# EAGLE schematic shared_pcb (EAGLE 7.5.0)
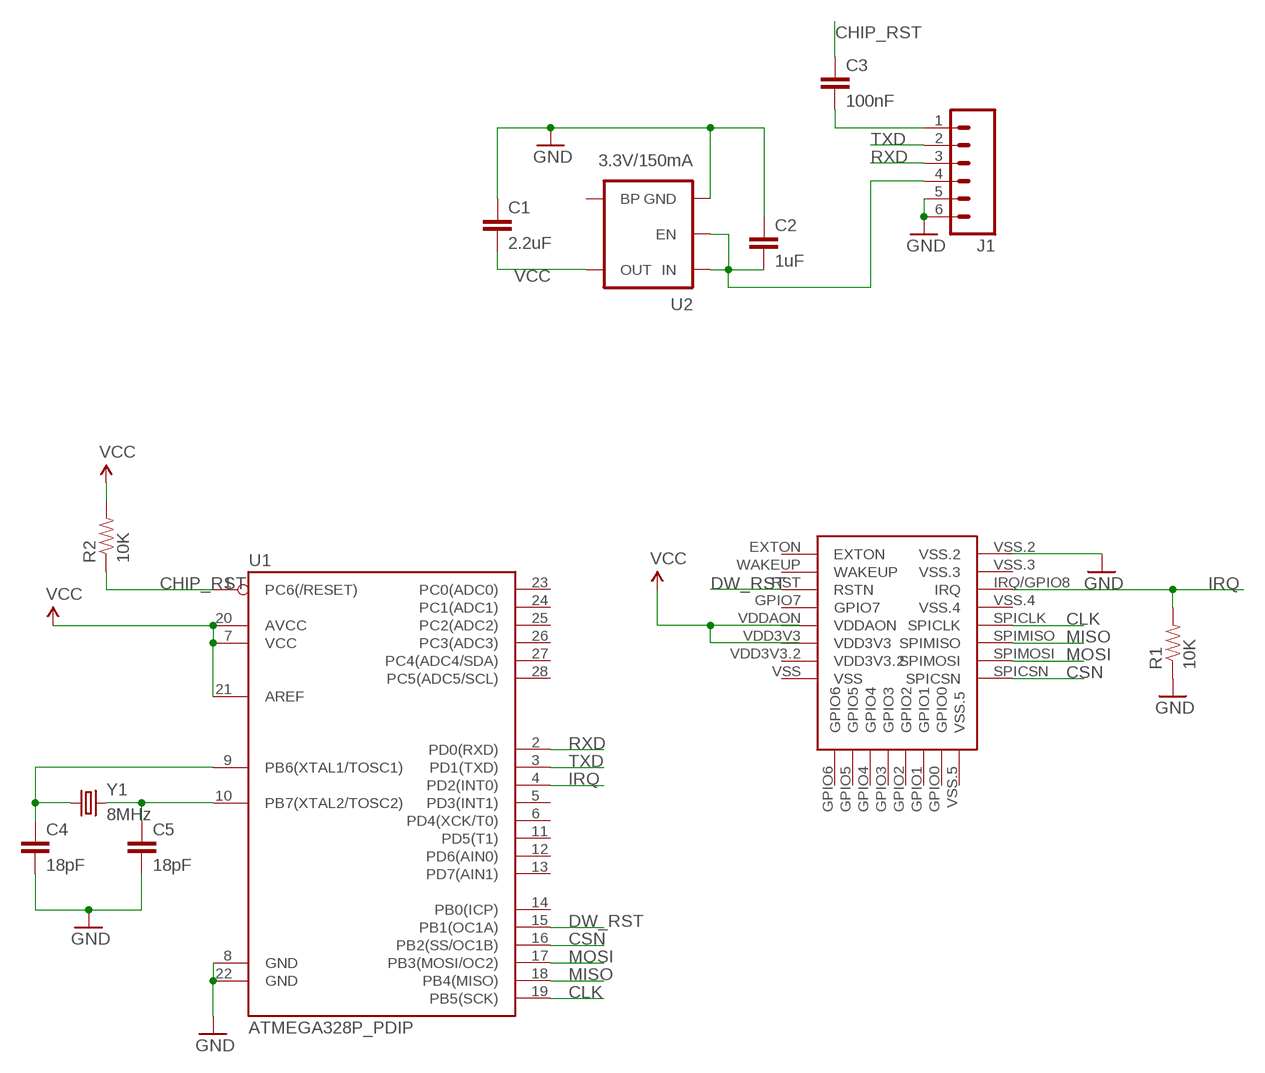
[diagram p0: schematic, sheet 1]

## Parts
C1  2.2uF  CAP1206  [1206]
C2  1uF  CAP1206  [1206]
C3  100nF  CAP1206  [1206]
C4  18pF  CAP1206  [1206]
C5  18pF  CAP1206  [1206]
J1  M06LOCK  [1X06_LOCK]
R1  10K  RESISTOR1206  [1206]
R2  10K  RESISTOR1206  [1206]
U1  ATMEGA328P_PDIP  [DIL28-3]
U2  3.3V/150mA  V_REG_MIC52053.3V  [SOT23-5]
U$1  DWM1000  [DWM1000]
Y1  8MHz  CRYSTALTXC-7A  [CRYSTAL-TXC-7A]

## Nets
CHIP_RST: C3.1 R2.1 U1.1(PC6(/RESET))
CLK: U1.19(PB5(SCK)) U$1.SPICLK
CSN: U1.16(PB2(SS/OC1B)) U$1.SPICSN
DW_RST: U1.15(PB1(OC1A)) U$1.RST(RSTN)
GND: C1.1 C2.1 C4.2 C5.2 J1.5 J1.6 R1.1 U1.8(GND) U1.22(GND) U2.2(GND) U$1.VSS.2
IRQ: R1.2 U1.4(PD2(INT0)) U$1.IRQ/GPIO8(IRQ)
MISO: U1.18(PB4(MISO)) U$1.SPIMISO
MOSI: U1.17(PB3(MOSI/OC2)) U$1.SPIMOSI
N$1: C4.1 U1.9(PB6(XTAL1/TOSC1)) Y1.P$1
N$2: C2.2 J1.4 U2.1(IN) U2.3(EN)
N$3: C3.2 J1.1
N$4: C5.1 U1.10(PB7(XTAL2/TOSC2)) Y1.P$2
RXD: J1.3 U1.2(PD0(RXD))
TXD: J1.2 U1.3(PD1(TXD))
VCC: C1.2 R2.2 U1.7(VCC) U1.20(AVCC) U1.21(AREF) U2.5(OUT)
Unconnected: U1.5(PD3(INT1)) U1.6(PD4(XCK/T0)) U1.11(PD5(T1)) U1.12(PD6(AIN0)) U1.13(PD7(AIN1)) U1.14(PB0(ICP)) U1.23(PC0(ADC0)) U1.24(PC1(ADC1)) U1.25(PC2(ADC2)) U1.26(PC3(ADC3)) U1.27(PC4(ADC4/SDA)) U1.28(PC5(ADC5/SCL)) U2.4(BP) U$1.EXTON U$1.GPIO0 U$1.GPIO1 U$1.GPIO2 U$1.GPIO3 U$1.GPIO4 U$1.GPIO5 U$1.GPIO6 U$1.GPIO7 U$1.VDD3V3 U$1.VDD3V3.2 U$1.VDDAON U$1.VSS U$1.VSS.3 U$1.VSS.4 U$1.VSS.5 U$1.WAKEUP

## Library data of the parts
C1-C5 = SparkFun-Capacitors:CAP: Capacitor Standard 0603 ceramic capacitor, and 0.1" leaded capacitor.
J1 = SparkFun-Connectors:M06: Header 6 Standard 6-pin 0.1" header. Use with straight break away headers (SKU : PRT-00116), right angle break away headers (PRT-00553), swiss pins (PRT-00743), machine pins (PRT-00117), and female headers (PRT-00115). Molex polarized connector foot print use with SKU : PRT-08094 with associated crimp pins and housings. NOTES ON THE VARIANTS LOCK and LOCK_LONGPADS... This footprint was designed to help hold the alignment of a through-hole component (i.e. 6-pin header) while soldering it into place. You may notice that each hole has been shifted either up or down by 0.005 of an inch from it's more standard position (which is a perfectly straight line). This slight alteration caused the pins (the squares in the middle) to touch the edges of the holes. Because they are alternating, it causes a "brace" to hold the component in place. 0.005 has proven to be the perfect amount of "off-center" position when using our standard breakaway headers. Although looks a little odd when you look at the bare footprint, once you have a header in there, the alteration is very hard to notice. Also,if you push a header all the way into place, it is covered up entirely on the bottom side. This idea of altering the position of holes to aid alignment will be further integrated into the Sparkfun Library for other footprints. It can help hold any component with 3 or more connection pins.
R1 R2 = SparkFun-Passives:RESISTOR: Resistor Basic schematic elements and footprints for 0603, 1206, and PTH resistors.
U1 = SparkFun-DigitalIC:ATMEGA328P_PDIP: uC used in the Arduino 32kb flash, 1k EEPROM, 2k SRAM This is the through-hole version of this chip.
U2 = SparkFun-PowerIC:V_REG_MIC5205: V_REG MIC5205 Standard 3.3V, 5V, and Adjustable 150mA LDO voltage regulator in SOT-23 layout. Micrel part MIC5205. BP (by-pass) pin is used to lower output noise with 470pF cap, may be left open. On the adjustable version BP is used to set output.; PROD_ID: VREG-00822
U$1 = DWM1000:DWM1000
Y1 = SparkFun-FreqCtrl:CRYSTAL: Various standard crystals. Proven footprints.